# Altium schematic sheet TIDA-01576_ADS8686S_AFE_Pg3-eFuse + 3.3V DC-DC.SchDoc: eFuse + 3.3V DC-DC
size 431 x 279 mm; Date: Not shown in title block; ApprovedBy: Not shown in title block; CheckedBy: Not shown in title block; Author: Not shown in title block; CompanyName: Not shown in title block; DrawnBy: Sreenivasa; Engineer: Not shown in title block; Organization: Not shown in title block; Address1: Not shown in title block; Address2: Not shown in title block; Address3: Not shown in title block; Address4: Not shown in title block; DocumentNumber: 1; Revision: Use project parameter SCH_Rev; SheetNumber: 3; SheetTotal: 7; PageSetup: Record=PageOptions|CenterHorizontal=True|CenterVertical=True|PrintScale=1.00|XCorrection=1.00|YCorrection=1.00|PrintKind=0|BorderSize=5000000|LeftOffset=0|BottomOffset=0|Orientation=2|PaperLength=1000|PaperWidth=1000|Scale=100|PaperSource=15|PrintQuality=600|MediaType=1|DitherType=10|PaperKind=Letter|PrintScaleMode=1; CurrentTime: Not shown in title block; CurrentDate: Not shown in title block; Time: Not shown in title block; DocumentFullPathAndName: Not shown in title block; DocumentName: Not shown in title block; ModifiedDate: Not shown in title block; ImagePath: Not shown in title block
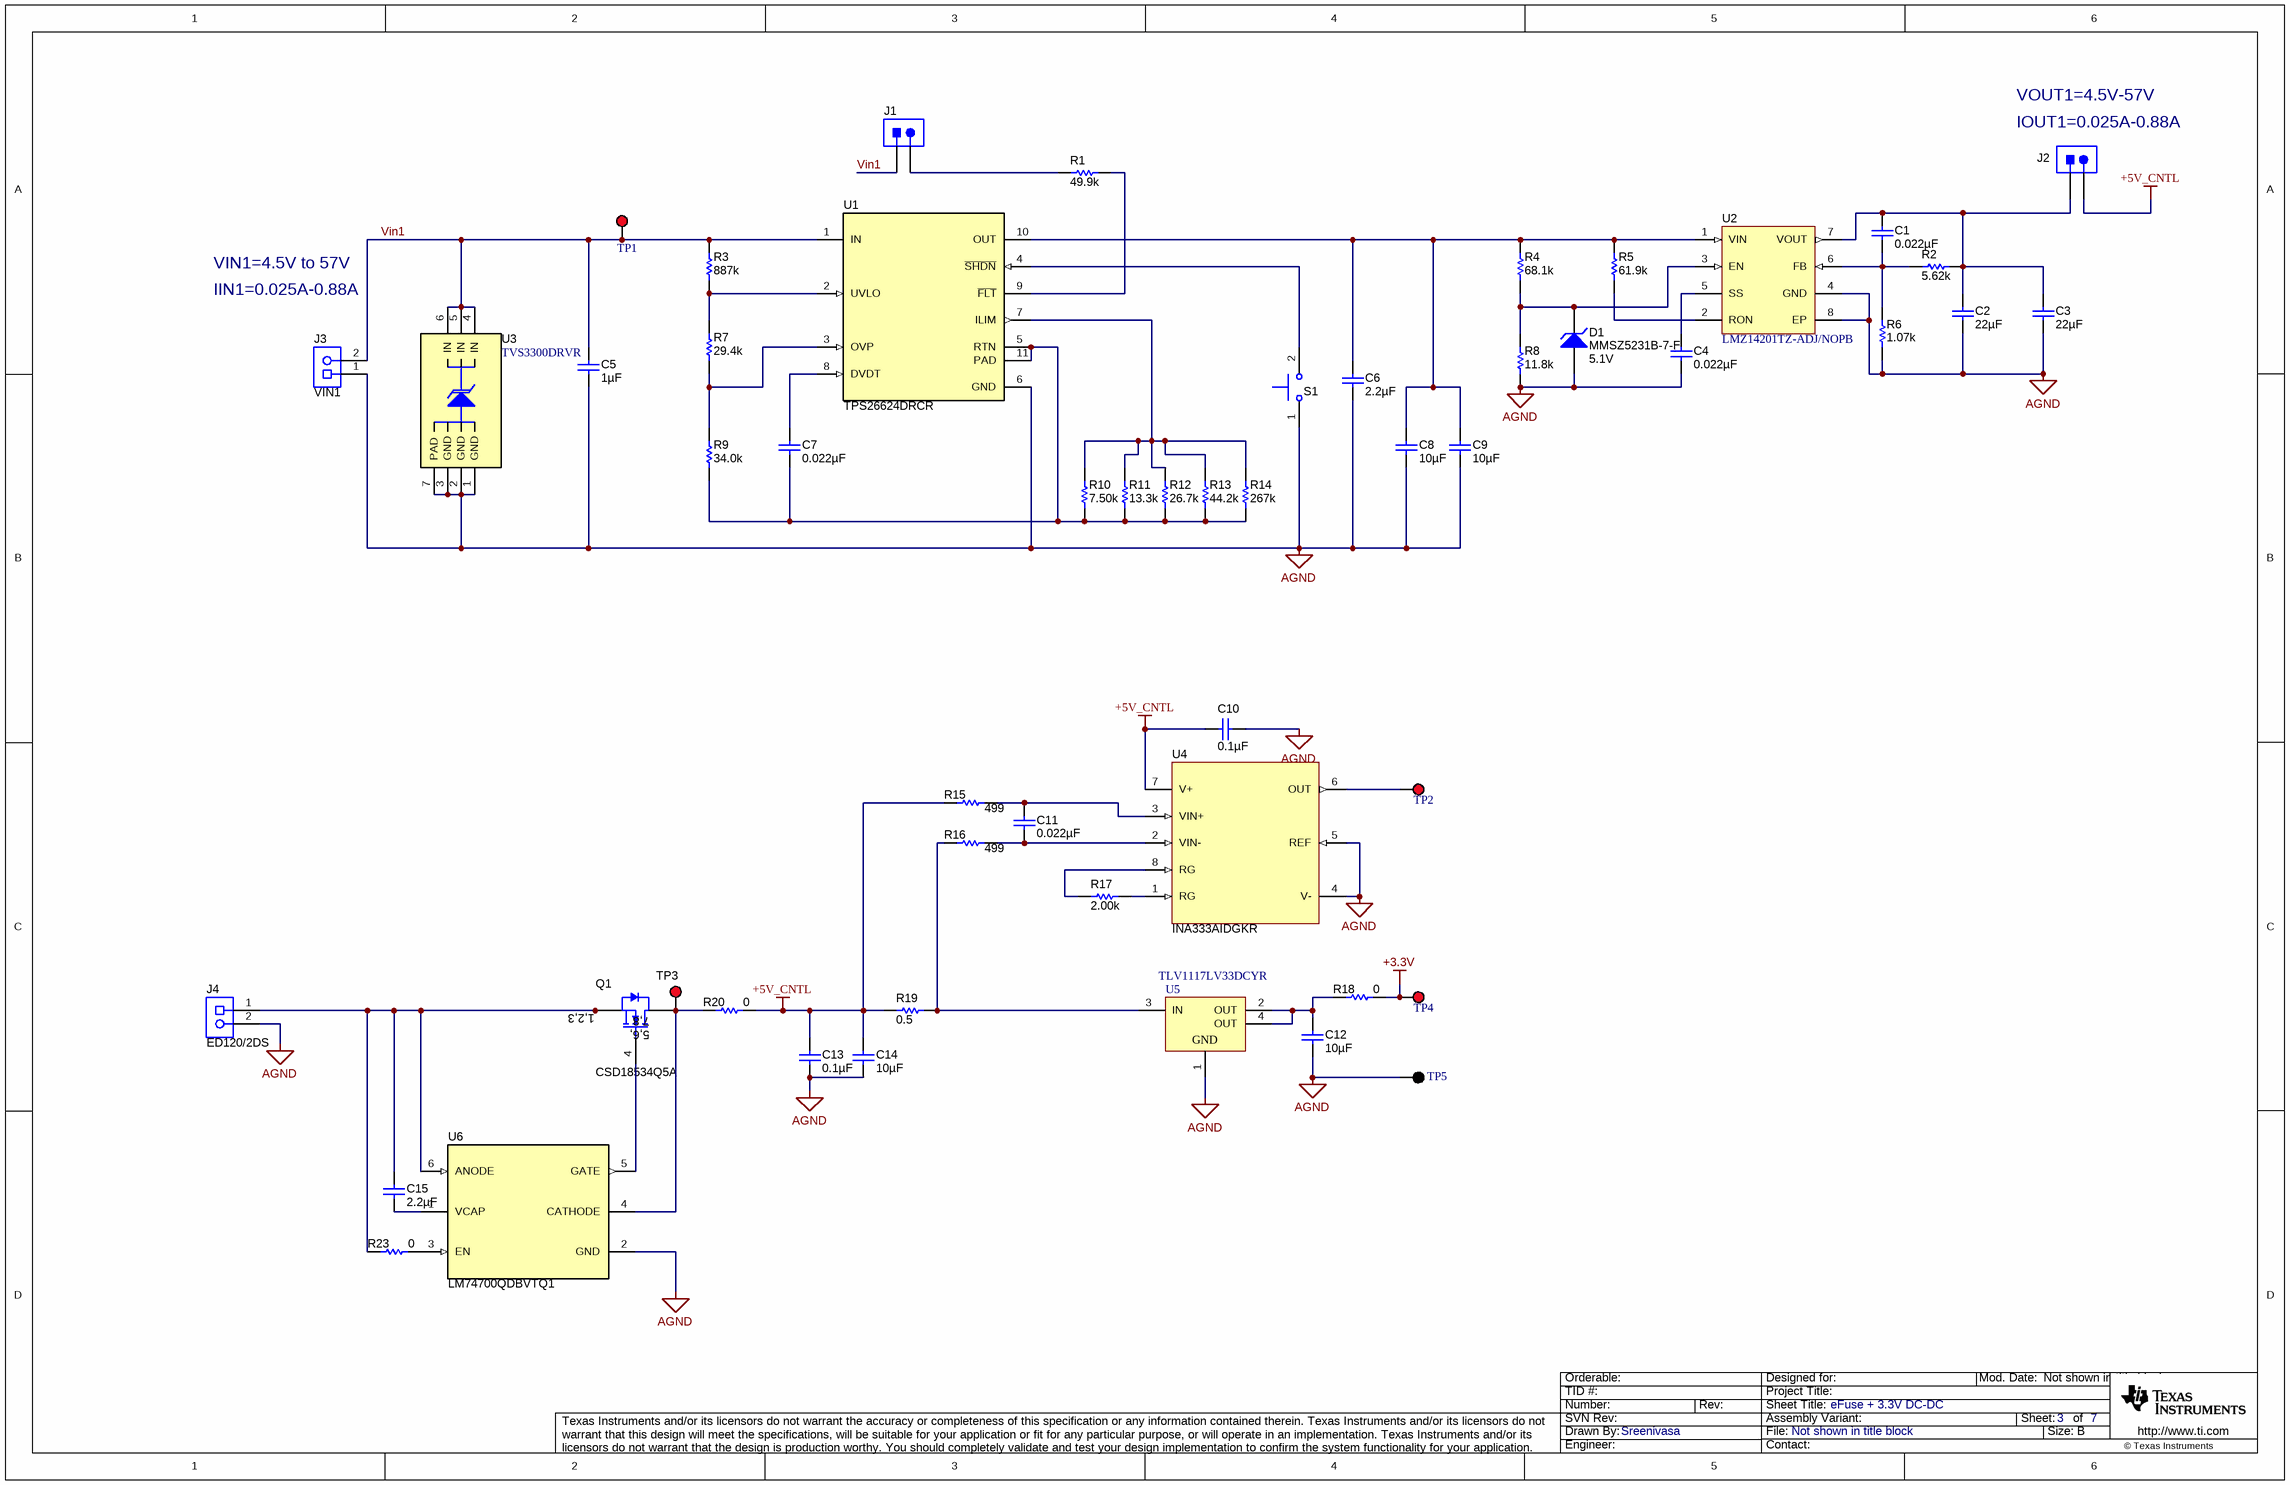
[diagram p0: TIDA-01576_ADS8686S_AFE_Pg3-eFuse + 3.3V DC-DC.SchDoc]

## Parts
C1  ValueDisplayed: 0.022µF  [0603]  (hidden comment: C0603C223K4RACTU)
C2  ValueDisplayed: 22µF  [1206_190]  (hidden comment: EMK316BB7226ML-T)
C3  ValueDisplayed: 22µF  [1206_190]  (hidden comment: EMK316BB7226ML-T)
C4  ValueDisplayed: 0.022µF  [0603]  (hidden comment: C0603C223K4RACTU)
C5  ValueDisplayed: 1µF  [1206_180M]  (hidden comment: GRM31CR72A105KA01L)
C6  ValueDisplayed: 2.2µF  [1210_270]  (hidden comment: GRM32ER72A225KA35L)
C7  ValueDisplayed: 0.022µF  [0603]  (hidden comment: GRM188R71C223KA01D)
C8  ValueDisplayed: 10µF  [1210_270]  (hidden comment: GRM32ER71J106KA12L)
C9  ValueDisplayed: 10µF  [1210_270]  (hidden comment: GRM32ER71J106KA12L)
C10  ValueDisplayed: 0.1µF  [0603M]  (hidden comment: 06033C104JAT2A)
C11  ValueDisplayed: 0.022µF  [0603M]  (hidden comment: C0603C223K3RACTU)
C12  ValueDisplayed: 10µF  [0603]  (hidden comment: C0603C106M9PACTU)
C13  ValueDisplayed: 0.1µF  [0603]  (hidden comment: C0603C104K5RACTU)
C14  ValueDisplayed: 10µF  [0603]  (hidden comment: C0603C106M9PACTU)
C15  ValueDisplayed: 2.2µF  [0805_HV]  (hidden comment: C0805C225K8RACTU)
D1  MMSZ5231B-7-F  value 5.1V  [SOD-123]
J1  PBC02SAAN  [Sullins_PBC02SAAN]  (value not drawn)
J2  PBC02SAAN  [Sullins_PBC02SAAN]  (value not drawn)
J3  VIN1  [TEC_282841-2]
J4  ED120/2DS  [CONN_ED120-2DS]
Q1  CSD18534Q5A  [DQJ0008A]
R1  ValueDisplayed: 49.9k  [0603]  (hidden comment: CRCW060349K9FKEA)
R2  ValueDisplayed: 5.62k  [0603]  (hidden comment: RC0603FR-075K62L)
R3  ValueDisplayed: 887k  [0603]  (hidden comment: CRCW0603887KFKEA)
R4  ValueDisplayed: 68.1k  [1206]  (hidden comment: CRCW120668K1FKEA)
R5  ValueDisplayed: 61.9k  [1206]  (hidden comment: RC1206FR-0761K9L)
R6  ValueDisplayed: 1.07k  [0603]  (hidden comment: ERA-3AEB1071V)
R7  ValueDisplayed: 29.4k  [0603]  (hidden comment: CRCW060329K4FKEA)
R8  ValueDisplayed: 11.8k  [1206]  (hidden comment: CRCW120611K8FKEA)
R9  ValueDisplayed: 34.0k  [0603]  (hidden comment: CRCW060334K0FKEA)
R10  ValueDisplayed: 7.50k  [0603]  (hidden comment: CRCW06037K50FKEA)
R11  ValueDisplayed: 13.3k  [0603]  (hidden comment: CRCW060313K3FKEA)
R12  ValueDisplayed: 26.7k  [0603]  (hidden comment: CRCW060326K7FKEA)
R13  ValueDisplayed: 44.2k  [0603]  (hidden comment: CRCW060344K2FKEA)
R14  ValueDisplayed: 267k  [0603]  (hidden comment: CRCW0603267KFKEA)
R15  value 499  [0402M]  (hidden comment: CRCW0402499RFKED)
R16  value 499  [0402M]  (hidden comment: CRCW0402499RFKED)
R17  ValueDisplayed: 2.00k  [0402]  (hidden comment: CRCW04022K00FKED)
R18  value 0  [0603]  (hidden comment: CRCW06030000Z0EA)
R19  ValueDisplayed: 0.5  [RL1220]  (hidden comment: RL1220S-R50-F)
R20  value 0  [0603]  (hidden comment: CRCW06030000Z0EA)
R23  value 0  [0603]  (hidden comment: CRCW06030000Z0EA)
S1  PTS820 J20M SMTR LFS  [SW_PTS820]  (value not drawn)
TP1  5000  [Keystone5000]  (value not drawn)
TP2  5000  [Keystone5000]  (value not drawn)
TP3  5000  [Keystone5000]  (value not drawn)
TP4  5000  [Keystone5000]  (value not drawn)
TP5  5001  [Keystone5001]  (value not drawn)
U1  TPS26624DRCR  [DRC0010J]
U2  LMZ14201TZ-ADJ/NOPB  [TZA07A_V]
U3  TVS3300DRVR  [DRV0006A]
U4  INA333AIDGKR  [DGK0008A_N]
U5  TLV1117LV33DCYR  [DCY0004A_N]
U6  LM74700QDBVTQ1  [DBV0006A_N]

## Nets
+3.3V: R18.2 TP4.1
+5V_CNTL: C10.2 C13.1 C14.1 J2.2 R15.1 R19.1 R20.2 U4.7(V+)
AGND: C2.2 C3.2 C4.2 C5.2 C6.2 C8.2 C9.2 C10.1 C12.2 C13.2 C14.2 D1.2(A) J3.1 J4.2 R6.1 R8.1 S1.1 TP5.1 U1.6(GND) U2.4(GND) U2.8(EP) U3.1(GND) U3.2(GND) U3.3(GND) U3.7(PAD) U4.4(V-) U4.5(REF) U5.1(GND) U6.2(GND)
Vin1: C5.1 J1.1 J3.2 R3.2 TP1.1 U1.1(IN) U3.4(IN) U3.5(IN) U3.6(IN)
NetC1_1: C1.1 C2.1 C3.1 J2.1 R2.2 U2.7(VOUT)
NetC1_2: C1.2 R2.1 R6.2 U2.6(FB)
NetC4_1: C4.1 U2.5(SS)
NetC6_1: C6.1 C8.1 C9.1 R4.2 R5.2 U1.10(OUT) U2.1(VIN)
NetC7_1: C7.1 U1.8(DVDT)
NetC7_2: C7.2 R9.1 R10.1 R11.1 R12.1 R13.1 R14.1 U1.5(RTN) U1.11(PAD)
NetC11_1: C11.1 R15.2 U4.3(VIN+)
NetC11_2: C11.2 R16.2 U4.2(VIN-)
NetC12_1: C12.1 R18.1 U5.2(OUT) U5.4(OUT)
NetC15_1: C15.1 J4.1 Q1.1(S) Q1.2(S) Q1.3(S) R23.1 U6.6(ANODE)
NetC15_2: C15.2 U6.1(VCAP)
NetD1_1: D1.1(K) R4.1 R8.2 U2.3(EN)
NetJ1_2: J1.2 R1.2
NetQ1_4: Q1.4(G) U6.5(GATE)
NetQ1_5: Q1.5(D) Q1.6(D) Q1.7(D) Q1.8(D) Q1.9(D) R20.1 TP3.1 U6.4(CATHODE)
NetR1_1: R1.1 U1.9(~{FLT})
NetR3_1: R3.1 R7.2 U1.2(UVLO)
NetR5_1: R5.1 U2.2(RON)
NetR7_1: R7.1 R9.2 U1.3(OVP)
NetR10_2: R10.2 R11.2 R12.2 R13.2 R14.2 U1.7(ILIM)
NetR16_1: R16.1 R19.2 U5.3(IN)
NetR17_1: R17.1 U4.1(RG)
NetR17_2: R17.2 U4.8(RG)
NetR23_2: R23.2 U6.3(EN)
NetS1_2: S1.2 U1.4(~{SHDN})
NetTP2_1: TP2.1 U4.6(OUT)

## Notes on the sheet
- VOUT1=4.5V-57V
- (near J2) IOUT1=0.025A-0.88A
- VIN1=4.5V to 57V
- IIN1=0.025A-0.88A
- Drawn By:
- SVN Rev:
- Number:
- TID #:
- Orderable:
- Rev:
- Sheet Title:
- File:
- Project Title:
- Designed for:
- Assembly Variant:
- Mod. Date:
- Sheet:
- Size:
- of
- B
- http://www.ti.com
- Texas Instruments and/or its licensors do not warrant the accuracy or completeness of this specification or any information contained therein. Texas Instruments and/or its licensors do not warrant that this design will meet the specifications, will be suitable for your application or fit for any particular purpose, or will operate in an implementation. Texas Instruments and/or its licensors do not warrant that the design is production worthy. You should completely validate and test your design implementation to confirm the system functionality for your application.
- Engineer:
- Contact:
- © Texas Instruments
- (in symbol CMP-0000817-1) 1,2,3; 7,8; 5,6,

## Library data of the parts
C1 C4 = C0603C223K4RACTU: CAP, CERM, 0.022 µF, 16 V,+/- 10%, X7R, 0603; Manufacturer: Kemet; Polarized: N; CompType: Capacitor; Value: 0.022uF; U/M: EA; Cap_F: 0.000000022; Tolerance_%: 10; Value1: Unknown; VDC_V: 16; Value2: 16V; TaMin_C: -55; TaMax_C: 125; SizeArea_mm2: 1.28; SizeAreaWB_mm2: 4.68; SizeX_mm: 1.6; SizeY_mm: 0.8; SizeZ_mm: 1; AEC Category: Q200; Green_Lifecycle: Active; Green_REACh: Passed; SymbolVersion: 2008-07-09; PartNumber: C0603C223K4RACTU; PackageReference: 0603; RoHS: Y; MountType: SMT; Technology: Ceramic; TempCo: X7R; Cap_Case: 0603; Published: 2008-06-19; Publisher: Texas Instruments; LatestRevisionDate: 2017-05-28; ComponentLink1Description: Datasheet link; ComponentLink1URL: http://www.kemet.com/kemet/web/homepage/kechome.nsf/vapubfiles/F3102_Y5V.pdf/$file/F3102_Y5V.pdf; Supplier 1: Digi-Key; Supplier Part Number 1: 399-1093-1-ND; Supplier 2: Mouser; Supplier Part Number 2: 80-C0603C223K4R; Supplier 3: Farnell; Supplier Part Number 3: 1204523; AEC Qualified: ?; Green_EU RoHS: Passed; Green_EU RoHS-2: Passed
C2 C3 = EMK316BB7226ML-T: CAP, CERM, 22 µF, 16 V,+/- 20%, X7R, 1206; Manufacturer: Taiyo Yuden; Polarized: N; CompType: Capacitor; Value: 22uF; U/M: EA; Cap_F: 0.000022; Tolerance_%: 20; Value1: Unknown; VDC_V: 16; Value2: 16V; TaMin_C: -55; TaMax_C: 125; Cap_Case: 1206; SizeArea_mm2: 5.12; SizeAreaWB_mm2: 10.92; SizeX_mm: 3.2; SizeY_mm: 1.6; SizeZ_mm: 1.9; AEC Category: Q200; SymbolVersion: 2008-07-09; PartNumber: EMK316BB7226ML-T; PackageReference: 1206; RoHS: Y; MountType: SMT; Technology: Ceramic; TempCo: X7R; Published: 2008-06-19; Publisher: Texas Instruments; LatestRevisionDate: 2017-05-28; ComponentLink1Description: Datasheet link; ComponentLink1URL: http://www.yuden.co.jp/productdata/catalog/en/mlcc_all_e.pdf; Supplier 1: Digi-Key; Supplier Part Number 1: 587-4319-1-ND; Supplier 2: Newark; Supplier Part Number 2: 52Y4678; Supplier 3: Mouser; Supplier Part Number 3: 963-EMK316BB7226ML-T; AEC Qualified: N; AEC Grade: N/A
C5 = GRM31CR72A105KA01L: CAP, CERM, 1 µF, 100 V, +/- 10%, X7R, 1206; Manufacturer: MuRata; Polarized: N; CompType: Capacitor; Value: 1uF; U/M: EA; Cap_F: 0.000001; Tolerance_%: 10; Value1: Unknown; VDC_V: 100; Value2: 100V; TaMin_C: -55; TaMax_C: 125; Cap_Case: 2220; SizeArea_mm2: 5.12; SizeAreaWB_mm2: 10.92; SizeX_mm: 3.2; SizeY_mm: 1.6; SizeZ_mm: 1.8; AEC Category: Q200; SymbolVersion: 2008-07-09; PartNumber: GRM31CR72A105KA01L; PackageReference: 1206; RoHS: Y; MountType: SMT; Technology: Ceramic; TempCo: X7R; Published: 2008-06-19; Publisher: Texas Instruments; LatestRevisionDate: 2016-06-23; ComponentLink1Description: Datasheet link; ComponentLink1URL: http://search.murata.co.jp/Ceramy/PnsearchViewAction.do?HnOFG=ON&HnNFG=ON&SEL_CNT=50&sLang=en&sKey=GRM31CR72A105KA01L&x=9&y=9&search=startwith; Supplier 1: Digi-Key; Supplier Part Number 1: 490-3909-1-ND; Supplier 2: Mouser; Supplier Part Number 2: 81-GRM31CR72A105KA01; Supplier 3: Farnell; Supplier Part Number 3: 1735543; AEC Qualified: ?
C6 = GRM32ER72A225KA35L: CAP, CERM, 2.2 µF, 100 V, +/- 10%, X7R, 1210; Manufacturer: MuRata; Polarized: N; CompType: Capacitor; Value: 2.2uF; U/M: EA; Cap_F: 0.0000022; Tolerance_%: 10; ESR_ohm: 0.007; Value1: 0.007 ohm; VDC_V: 100; Value2: 100V; IRMS_A: 4.4; TaMin_C: -55; TaMax_C: 125; Cap_Case: 1210; SizeArea_mm2: 8; SizeAreaWB_mm2: 14.7; SizeX_mm: 3.2; SizeY_mm: 2.5; SizeZ_mm: 2.7; AEC Category: Q200; SymbolVersion: 2008-07-09; PartNumber: GRM32ER72A225KA35L; PackageReference: 1210; RoHS: Y; MountType: SMT; Technology: Ceramic; TempCo: X7R; Published: 2008-06-19; Publisher: Texas Instruments; LatestRevisionDate: 2017-01-30; ComponentLink1Description: Datasheet link; ComponentLink1URL: http://search.murata.co.jp/Ceramy/PnsearchViewAction.do?HnOFG=ON&HnNFG=ON&SEL_CNT=50&sLang=en&sKey=GRM32ER72A225KA35L&x=9&y=9&search=startwith; Supplier 1: Digi-Key; Supplier Part Number 1: 490-3385-1-ND; Supplier 2: Mouser; Supplier Part Number 2: 81-GRM32ER72A225KA35; Supplier 3: Farnell; Supplier Part Number 3: 1735547; AEC Qualified: ?
C7 = GRM188R71C223KA01D: CAP, CERM, 0.022 µF, 16 V,+/- 10%, X7R, 0603; Manufacturer: MuRata; Polarized: N; CompType: Capacitor; Value: 0.022uF; U/M: EA; Cap_F: 0.000000022; Tolerance_%: 10; VDC_V: 16; Value2: 16V; TaMin_C: -55; TaMax_C: 125; SizeArea_mm2: 1.28; SizeAreaWB_mm2: 4.68; SizeX_mm: 1.6; SizeY_mm: 0.8; SizeZ_mm: 1; AEC Category: Q200; Green_Lifecycle: Active; Green_REACh: Passed; SymbolVersion: 2008-07-09; PartNumber: GRM188R71C223KA01D; PackageReference: 0603; RoHS: Y; MountType: SMT; Technology: Ceramic; TempCo: X7R; Cap_Case: 0603; Published: 2008-06-19; Publisher: Texas Instruments; LatestRevisionDate: 2017-06-22; ComponentLink1Description: Datasheet link; ComponentLink1URL: http://search.murata.co.jp/Ceramy/PnsearchViewAction.do?HnOFG=ON&HnNFG=ON&SEL_CNT=50&sLang=en&sKey=GRM188R71C223KA01D&x=9&y=9&search=startwith; Supplier 1: Digi-Key; Supplier Part Number 1: 490-1527-1-ND; Supplier 2: Mouser; Supplier Part Number 2: 81-GRM39X223K16D; AEC Qualified: ?; Green_EU RoHS: Passed; Green_EU RoHS-2: Incomplete
C8 C9 = GRM32ER71J106KA12L: CAP, CERM, 10 µF, 63 V, +/- 10%, X7R, 1210; Manufacturer: MuRata; Polarized: N; CompType: Capacitor; Value: 10uF; U/M: EA; Cap_F: 0.00001; Tolerance_%: 10; Value1: Unknown; VDC_V: 63; Value2: 63V; TaMin_C: -55; TaMax_C: 125; Cap_Case: 1210; SizeArea_mm2: 8; SizeAreaWB_mm2: 14.7; SizeX_mm: 3.2; SizeY_mm: 2.5; SizeZ_mm: 2.7; AEC Category: Q200; SymbolVersion: 2008-07-09; PartNumber: GRM32ER71J106KA12L; PackageReference: 1210; RoHS: Y; MountType: SMT; Technology: Ceramic; TempCo: X7R; Published: 2008-06-19; Publisher: Texas Instruments; LatestRevisionDate: 2016-12-20; ComponentLink1Description: Datasheet link; ComponentLink1URL: http://psearch.en.murata.com/capacitor/product/GRM32ER71J106KA12%23.pdf; Supplier 1: Digi-Key; Supplier Part Number 1: 490-9970-1-ND; Supplier 2: Mouser; Supplier Part Number 2: 81-GRM32ER71J106KA2L; AEC Qualified: N; AEC Grade: N/A
C10 = 06033C104JAT2A: CAP, CERM, 0.1uF, 25V, +/-5%, X7R, 0603; Manufacturer: AVX; Polarized: N; CompType: Capacitor; U/M: EA; Cap_F: 0.0000001; Tolerance_%: 5; ESR_Ohm: 0.05; Value1: 0.05 ohm; VDC_V: 25; TaMin_C: -55; TaMax_C: 125; Cap_Case: 0603; SymbolVersion: 2008-07-09; Value: 0.1uF; PartNumber: 06033C104JAT2A; PackageReference: 0603; RoHS: Y; Value2: 25V; MountType: SMT; Technology: Ceramic; TempCo: X7R; Published: 2008-06-19; Publisher: Texas Instruments; LatestRevisionDate: 2013-06-11; ComponentLink1Description: Datasheet link; ComponentLink1URL: http://www.avx.com/docs/masterpubs/smccp.pdf; Supplier 1: Digi-Key; Supplier Part Number 1: 478-3713-1-ND; Supplier 2: Mouser; Supplier Part Number 2: 581-06033C104JAT2A; Supplier 3: Farnell; Supplier Part Number 3: 1740614
C11 = C0603C223K3RACTU: CAP, CERM, 0.022uF, 25V, +/-10%, X7R, 0603; Manufacturer: Kemet; Polarized: N; CompType: Capacitor; U/M: EA; Cap_F: 0.000000022; Tolerance_%: 10; Value1: Unknown; VDC_V: 25; TaMin_C: -55; TaMax_C: 125; Cap_Case: 0603; SymbolVersion: 2008-07-09; Value: 0.022uF; PartNumber: C0603C223K3RACTU; PackageReference: 0603; RoHS: Y; Value2: 25V; MountType: SMT; Technology: Ceramic; TempCo: X7R; Published: 2008-06-19; Publisher: Texas Instruments; LatestRevisionDate: 2014-01-01; ComponentLink1Description: Datasheet link; ComponentLink1URL: http://www.kemet.com/kemet/web/homepage/kechome.nsf/vapubfiles/F3102_Y5V.pdf/$file/F3102_Y5V.pdf; Supplier 1: Digi-Key; Supplier Part Number 1: 399-1094-1-ND; Supplier 2: Mouser; Supplier Part Number 2: 80-C0603C223K3R; Supplier 3: Farnell; Supplier Part Number 3: 1204523
C12 C14 = C0603C106M9PACTU: CAP, CERM, 10 µF, 6.3 V, +/- 20%, X5R, 0603; Manufacturer: Kemet; Polarized: N; CompType: Capacitor; Value: 10uF; U/M: EA; Cap_F: 0.00001; Tolerance_%: 20; ESR_ohm: 0.004; Value1: 0.004 ohm; VDC_V: 6.3; Value2: 6.3V; IRMS_A: 8.9; TaMin_C: -55; TaMax_C: 85; SymbolVersion: 2008-07-09; PartNumber: C0603C106M9PACTU; PackageReference: 0603; RoHS: Y; MountType: SMT; Technology: Ceramic; TempCo: X5R; Cap_Case: 0603; Published: 2008-06-19; Publisher: Texas Instruments; LatestRevisionDate: 2015-03-22; ComponentLink1Description: Datasheet link; ComponentLink1URL: http://www.kemet.com/kemet/web/homepage/kechome.nsf/vapubfiles/F3102_Y5V.pdf/$file/F3102_Y5V.pdf; Supplier 1: Digi-Key; Supplier Part Number 1: 399-5504-1-ND; Supplier 2: Mouser; Supplier Part Number 2: 80-C0603C106M9P; Supplier 3: Farnell; Supplier Part Number 3: 1288201
C13 = C0603C104K5RACTU: CAP, CERM, 0.1uF, 50V, +/-10%, X7R, 0603; Manufacturer: Kemet; Polarized: N; CompType: Capacitor; U/M: EA; Cap_F: 0.0000001; Tolerance_%: 10; Value1: Unknown; VDC_V: 50; TaMin_C: -55; TaMax_C: 125; SymbolVersion: 2008-07-09; Value: 0.1uF; PartNumber: C0603C104K5RACTU; PackageReference: 0603; RoHS: Y; Value2: 50V; MountType: SMT; Technology: Ceramic; TempCo: X7R; Cap_Case: 0603; Published: 2008-06-19; Publisher: Texas Instruments; LatestRevisionDate: 2013-11-21; ComponentLink1Description: Datasheet link; ComponentLink1URL: http://www.kemet.com/kemet/web/homepage/kechome.nsf/vapubfiles/F3102_Y5V.pdf/$file/F3102_Y5V.pdf; Supplier 1: Digi-Key; Supplier Part Number 1: 399-5089-1-ND; Supplier 2: Mouser; Supplier Part Number 2: 80-C0603C104K5R; Supplier 3: Farnell; Supplier Part Number 3: 1288255
C15 = C0805C225K8RACTU: CAP, CERM, 2.2uF, 10V, +/-10%, X7R, 0805; Manufacturer: Kemet; Polarized: N; CompType: Capacitor; U/M: EA; Cap_F: 0.0000022; Tolerance_%: 10; ESR_Ohm: 0.008; Value1: 0.008 ohm; IRMS_A: 15.55; TaMin_C: -55; TaMax_C: 125; Cap_Case: 0805; SymbolVersion: 2008-07-09; Value: 2.2uF; PartNumber: C0805C225K8RACTU; PackageReference: 0805; RoHS: Y; VDC_V: 10; Value2: 10V; MountType: SMT; Technology: Ceramic; TempCo: X7R; Published: 2008-06-19; Publisher: Texas Instruments; LatestRevisionDate: 2014-05-28; ComponentLink1Description: Datasheet link; ComponentLink1URL: http://www.kemet.com/kemet/web/homepage/kechome.nsf/file/Partial%20Copy%20-%20Ceramic%20Surface%20Mount%20Capacitors/$file/F3102_CE.pdf; Supplier 1: Digi-Key; Supplier Part Number 1: 399-3522-1-ND; Supplier 2: Mouser; Supplier Part Number 2: 80-C0805C225K8R
D1 = MMSZ5231B-7-F: Diode, Zener, 5.1 V, 500 mW, SOD-123; Manufacturer: Diodes Inc.; SymbolCreator: a0412235; U/M: EA; Power_W: 0.5; Vz_V: 5.1; Value1: 0.5W; RJA_CperW: 350; SizeAreaWB_mm2: 13.095; SizeArea_mm2: 6.545; SizeX_mm: 3.85; SizeY_mm: 1.7; SizeZ_mm: 1.35; AEC Category: Q101; Green_Lifecycle: Active; Green_REACh: Passed; SymbolVersion: 2010-08-25; PartNumber: MMSZ5231B-7-F; PackageReference: SOD-123; CompType: Zener; Vr_V: N/A; MountType: SMT; RoHS: Y; ComponentLink1Description: Datasheet link; ComponentLink1URL: http://www.diodes.com/datasheets/ds18010.pdf; Published: 2008-10-08; Publisher: Texas Instruments; LatestRevisionDate: 2017-05-11; LatestRevisionNote: Updated Supplier Data; Supplier 1: Digi-Key; Supplier Part Number 1: MMSZ5231B-FDICT-ND; Supplier 2: Mouser; Supplier Part Number 2: 621-MMSZ5231B-F; Supplier 3: Farnell; Supplier Part Number 3: 1843699; AEC Qualified: ?; Green_EU RoHS: Passed; Green_EU RoHS-2: Passed
J1 J2 = PBC02SAAN: Header, 100mil, 2x1, Gold, TH; Manufacturer: Sullins Connector Solutions; SymbolCreator: a0412235; Pitch_mm: 2.54; Gender: Male; Shrouded: N; Row_Count: 1; Current_A: 3; Voltage_V: 1800; Cert_UL: Y; SymbolVersion: 2013-10-31; PartNumber: PBC02SAAN; ClassName: Header; CompType: Header; RoHS: Y; PackageReference: Sullins 100mil, 1x2, 230 mil above insulator; MountType: TH; ComponentLink1Description: Datasheet URL; ComponentLink1URL: http://www.sullinscorp.com/catalogs/77_PAGE108-109_.100_MALE_HDR.pdf; Publisher: Texas Instruments; LatestRevisionDate: 2016-06-23; Supplier 1: Digi-Key; Supplier Part Number 1: S1011E-02-ND; Orientation: Vertical; PinCount: 2; ContactFinish: Gold; Color: Black
J3 = CMP-0054973-1: Terminal Block, 2x1, 5.08mm, TH; Manufacturer: TE Connectivity; PartNumber: 282841-2; CNHeader: FALSE; Green_Lifecycle: Active; Green_REACh: Passed; CT: TRUE; CompType: Terminal Block; MountType: TH; RoHS: Y; PackageReference: 10.16x15.2x9mm; ComponentLink1Description: Datasheet URL; ComponentLink1URL: http://www.te.com/commerce/DocumentDelivery/DDEController?Action=srchrtrv&DocNm=282841&DocType=Customer+Drawing&DocLang=English; Supplier 1: Digi-Key; Supplier Part Number 1: A98342-ND; Publisher: Texas Instruments; LatestRevisionDate: 26/05/2017; Supplier 2: Newark; Supplier Part Number 2: 12H8419; Supplier 3: Mouser; Supplier Part Number 3: 571-2828412; Green_EU RoHS-2: Incomplete; Green_EU RoHS: Passed with Exemption
J4 = ED120/2DS: TERMINAL BLOCK 5.08MM VERT 2POS, TH; Manufacturer: On-Shore Technology; SymbolCreator: a0412235; U/M: EA; SymbolVersion: 2013-09-04; PartNumber: ED120/2DS; PackageReference: TERM_BLK, 2pos, 5.08mm; CompType: Terminal Block; RoHS: Y; MountType: TH; ComponentLink1Description: Datasheet Link; ComponentLink1URL: http://www.on-shore.com/sites/default/files/manuals/ed120ds.pdf; Publisher: Texas Instruments; LatestRevisionDate: 2013-12-06; Supplier 1: Digi-Key; Supplier Part Number 1: ED1609-ND
Q1 = CMP-0000817-1: MOSFET, N-CH, 60 V, 50 A, DQJ0008A (VSONP-8); Alternate Manufacturer: None; Manufacturer: Texas Instruments; SizeZ_mm: 1.1; ChType: N; Value2: 22 nC; Value1: 0.009; VdsMax_V: 60V; SizeX_mm: 6; SizeY_mm: 4.9; Vgs_V: 2.3V; Value: 60V; Rdson45_ohm: 9.8m; SizeArea_mm2: 29.4; AEC Category: Q101; IdsMax_A: 50A; SizeAreaWB_mm2: 55.2; U/M: EA; QgTyp_nC: 22; Supplier 2: Newark; Supplier 3: Mouser; Supplier 1: Digi-Key; Supplier Part Number 1: 296-35583-1-ND; Supplier Part Number 2: 63W3706; PartNumber: CSD18534Q5A; ComponentLink1Description: Datasheet link; LatestRevisionDate: 2017-03-09; ComponentLink1URL: http://www.ti.com/lit/ds/symlink/csd18534q5a.pdf; CompType: MOSFET; PackageReference: DQJ0008A; LatestRevisionNote: Added parts.; Publisher: Texas Instruments; AEC Qualified: N; Published: 2008-06-19; Supplier Part Number 3: 595-CSD18534Q5A; RoHS: Y; MountType: SMT
R1 = CRCW060349K9FKEA: RES, 49.9 k, 1%, 0.1 W, 0603; Manufacturer: Vishay-Dale; CompType: Resistor; Value: 49.9k; Res_ohm: 49900; Value_Code: 49k9; Tolerance_%: 1; Power_W: 0.1; Value2: 0.1W; VDC_V: 75; TempCo: 100 ppm/C; EIA_Code: E96; U/M: EA; SizeArea_mm2: 1.28; SizeX_mm: 1.6; SizeY_mm: 0.8; AEC Category: Q200; Green_Lifecycle: Active; Green_REACh: Passed; SymbolVersion: 2009-05-29; PartNumber: CRCW060349K9FKEA; PackageReference: 0603; RoHS: Y; Value1: 1%; MountType: SMT; Technology: Thick Film; Published: 2008-06-26; Publisher: Texas Instruments; LatestRevisionDate: 2017-06-13; ComponentLink1Description: Datasheet link; ComponentLink1URL: http://www.vishay.com/docs/20035/dcrcwe3.pdf; Supplier 1: Digi-Key; Supplier Part Number 1: 541-49.9KHCT-ND; Supplier 2: Mouser; Supplier Part Number 2: 71-CRCW0603-49.9K-E3; Supplier 3: Farnell; Supplier Part Number 3: 1652882; SizeZ_mm: 1; AEC Qualified: ?; Green_EU RoHS: Passed with Exemption; Green_EU RoHS-2: Passed
R2 = RC0603FR-075K62L: RES, 5.62 k, 1%, 0.1 W, 0603; Manufacturer: Yageo America; CompType: Resistor; Value: 5.62k; Res_ohm: 5620; Value_Code: 5k62; Tolerance_%: 1; Power_W: 0.1; Value2: 0.1W; VDC_V: 150; TempCo: 200 ppm/C; SizeArea_mm2: 1.28; SizeX_mm: 1.6; SizeY_mm: 0.8; EIA_Code: E96; U/M: EA; AEC Category: Q200; Green_Lifecycle: Active; Green_REACh: Passed; SymbolVersion: 2009-05-29; PartNumber: RC0603FR-075K62L; PackageReference: 0603; RoHS: Y; Value1: 1%; MountType: SMT; Technology: Thick Film; SizeZ_mm: 1; Published: 2008-06-26; Publisher: Texas Instruments; LatestRevisionDate: 2017-06-13; ComponentLink1Description: Datasheet link; ComponentLink1URL: http://www.yageo.com/pdf/Pu-RC0603_51_PbFree_L_2.pdf; Supplier 1: Digi-Key; Supplier Part Number 1: 311-5.62KHRCT-ND; Supplier 2: Mouser; Supplier Part Number 2: 603-RC0603FR-075K62L; Supplier 3: Farnell; Supplier Part Number 3: 4760311; AEC Qualified: ?; Green_EU RoHS: Passed with Exemption; Green_EU RoHS-2: Passed
R3 = CRCW0603887KFKEA: RES, 887 k, 1%, 0.1 W, 0603; Manufacturer: Vishay-Dale; CompType: Resistor; Value: 887k; Res_ohm: 887000; Tolerance_%: 1; Power_W: 0.1; Value2: 0.1W; VDC_V: 75; TempCo: 100 ppm/C; SizeArea_mm2: 1.28; SizeX_mm: 1.6; SizeY_mm: 0.8; EIA_Code: E96; U/M: EA; AEC Category: Q200; Green_Lifecycle: Active; Green_REACh: Passed; SymbolVersion: 2009-05-29; PartNumber: CRCW0603887KFKEA; PackageReference: 0603; RoHS: Y; Value_Code: 887k; Value1: 1%; MountType: SMT; Technology: Thick Film; SizeZ_mm: 1; Published: 2008-06-26; Publisher: Texas Instruments; LatestRevisionDate: 2017-06-13; ComponentLink1Description: Datasheet link; ComponentLink1URL: http://www.vishay.com/docs/20035/dcrcwe3.pdf; Supplier 1: Digi-Key; Supplier Part Number 1: 541-887KHCT-ND; Supplier 2: Newark; Supplier Part Number 2: 52K8757; Supplier 3: Mouser; Supplier Part Number 3: 71-CRCW0603-887K-E3; AEC Qualified: ?; Green_EU RoHS: Passed with Exemption; Green_EU RoHS-2: Passed
R4 = CRCW120668K1FKEA: RES, 68.1 k, 1%, 0.25 W, 1206; Manufacturer: Vishay-Dale; CompType: Resistor; Value: 68.1k; Res_ohm: 68100; Value_Code: 68k1; Tolerance_%: 1; Power_W: 0.25; Value2: 0.25W; VDC_V: 200; TempCo: 100 ppm/C; SizeArea_mm2: 5.12; SizeX_mm: 3.2; SizeY_mm: 1.6; SizeZ_mm: 1.35; EIA_Code: E96; U/M: EA; AEC Category: Q200; SymbolVersion: 2009-05-29; PartNumber: CRCW120668K1FKEA; PackageReference: 1206; RoHS: Y; Value1: 1%; MountType: SMT; Technology: Thick Film; Published: 2008-06-26; Publisher: Texas Instruments; LatestRevisionDate: 2017-05-17; ComponentLink1Description: Datasheet link; ComponentLink1URL: http://www.vishay.com/docs/20035/dcrcwe3.pdf; Supplier 1: Digi-Key; Supplier Part Number 1: 541-68.1KFCT-ND; Supplier 2: Newark; Supplier Part Number 2: 53K2570; Supplier 3: Mouser; Supplier Part Number 3: 71-CRCW1206-68.1K-E3; AEC Qualified: ?
R5 = RC1206FR-0761K9L: RES, 61.9 k, 1%, 0.25 W, 1206; Manufacturer: Yageo America; CompType: Resistor; Value: 61.9k; Res_ohm: 61900; Value_Code: 61k9; Tolerance_%: 1; Power_W: 0.25; Value2: 0.25W; VDC_V: 200; TempCo: 100 ppm/C; SizeArea_mm2: 5.12; SizeX_mm: 3.2; SizeY_mm: 1.6; SizeZ_mm: 1.35; EIA_Code: E96; U/M: EA; AEC Category: Q200; SymbolVersion: 2009-05-29; PartNumber: RC1206FR-0761K9L; PackageReference: 1206; RoHS: Y; Value1: 1%; MountType: SMT; Technology: Thick Film; Published: 2008-06-26; Publisher: Texas Instruments; LatestRevisionDate: 2017-05-17; ComponentLink1Description: Datasheet link; ComponentLink1URL: http://www.yageo.com/pdf/Pu-RC1206_51_PbFree_L_2.pdf; Supplier 1: Digi-Key; Supplier Part Number 1: 311-61.9KFRCT-ND; Supplier 2: Mouser; Supplier Part Number 2: 603-RC1206FR-0761K9L; AEC Qualified: ?
R6 = RT0603DRE071K07L: RES SMD 1.07KOHM 0.1% 1/10W 0603; Manufacturer: Panasonic; CompType: Resistor; Value: 1.07k; Res_ohm: 1070; Value_Code: 1k07; Tolerance_%: 0.5; Value1: 0.5%; Power_W: 0.1; Value2: 0.1W; VDC_V: 75; TempCo: 50 ppm/C; SizeArea_mm2: 1.28; SizeX_mm: 1.6; SizeY_mm: 0.8; SizeZ_mm: 1; EIA_Code: E192; U/M: EA; AEC Category: Q200; SymbolVersion: 2009-05-29; PartNumber: ERA-3AEB1071V; PackageReference: 0603; RoHS: Y; MountType: SMT; Technology: Thin Film; Published: 2008-06-26; Publisher: Texas Instruments; LatestRevisionDate: 2017-05-04; ComponentLink1Description: Datasheet link; ComponentLink1URL: http://www.yageo.com/pdf/PYu-RT_1-to-0.05_RoHS_L_3.pdf; Supplier 1: Digi-Key; Supplier Part Number 1: P1.07KDBCT-ND; AEC Qualified: ?
R7 = CRCW060329K4FKEA: RES, 29.4 k, 1%, 0.1 W, 0603; Manufacturer: Vishay-Dale; CompType: Resistor; Value: 29.4k; Res_ohm: 29400; Value_Code: 29k4; Tolerance_%: 1; Power_W: 0.1; Value2: 0.1W; VDC_V: 75; TempCo: 100 ppm/C; SizeArea_mm2: 1.28; SizeX_mm: 1.6; SizeY_mm: 0.8; EIA_Code: E96; U/M: EA; AEC Category: Q200; Green_Lifecycle: Active; Green_REACh: Passed; SymbolVersion: 2009-05-29; PartNumber: CRCW060329K4FKEA; PackageReference: 0603; RoHS: Y; Value1: 1%; MountType: SMT; Technology: Thick Film; SizeZ_mm: 1; Published: 2008-06-26; Publisher: Texas Instruments; LatestRevisionDate: 2017-06-13; ComponentLink1Description: Datasheet link; ComponentLink1URL: http://www.vishay.com/docs/20035/dcrcwe3.pdf; Supplier 1: Digi-Key; Supplier Part Number 1: 541-29.4KHCT-ND; Supplier 2: Newark; Supplier Part Number 2: 52K8364; Supplier 3: Mouser; Supplier Part Number 3: 71-CRCW0603-29.4K-E3; AEC Qualified: ?; Green_EU RoHS: Passed with Exemption; Green_EU RoHS-2: Passed
R8 = CRCW120611K8FKEA: RES, 11.8 k, 1%, 0.25 W, 1206; Manufacturer: Vishay-Dale; CompType: Resistor; Value: 11.8k; Res_ohm: 11800; Value_Code: 11k8; Tolerance_%: 1; Power_W: 0.25; Value2: 0.25W; VDC_V: 200; TempCo: 100 ppm/C; SizeArea_mm2: 5.12; SizeX_mm: 3.2; SizeY_mm: 1.6; SizeZ_mm: 1.35; EIA_Code: E96; U/M: EA; AEC Category: Q200; SymbolVersion: 2009-05-29; PartNumber: CRCW120611K8FKEA; PackageReference: 1206; RoHS: Y; Value1: 1%; MountType: SMT; Technology: Thick Film; Published: 2008-06-26; Publisher: Texas Instruments; LatestRevisionDate: 2017-05-17; ComponentLink1Description: Datasheet link; ComponentLink1URL: http://www.vishay.com/docs/20035/dcrcwe3.pdf; Supplier 1: Digi-Key; Supplier Part Number 1: 541-11.8KFCT-ND; Supplier 2: Newark; Supplier Part Number 2: 53K1933; Supplier 3: Mouser; Supplier Part Number 3: 71-CRCW1206-11.8K-E3; AEC Qualified: ?
R9 = CRCW060334K0FKEA: RES, 34.0 k, 1%, 0.1 W, 0603; Manufacturer: Vishay-Dale; CompType: Resistor; Value: 34.0k; Res_ohm: 34000; Value_Code: 34k0; Tolerance_%: 1; Power_W: 0.1; Value2: 0.1W; VDC_V: 75; TempCo: 100 ppm/C; EIA_Code: E96; U/M: EA; SizeArea_mm2: 1.28; SizeX_mm: 1.6; SizeY_mm: 0.8; AEC Category: Q200; SymbolVersion: 2009-05-29; PartNumber: CRCW060334K0FKEA; PackageReference: 0603; RoHS: Y; Value1: 1%; MountType: SMT; Technology: Thick Film; Published: 2008-06-26; Publisher: Texas Instruments; LatestRevisionDate: 2017-06-13; ComponentLink1Description: Datasheet link; ComponentLink1URL: http://www.vishay.com/docs/20035/dcrcwe3.pdf; Supplier 1: Digi-Key; Supplier Part Number 1: 541-34.0KHCT-ND; Supplier 2: Newark; Supplier Part Number 2: 52K8436; Supplier 3: Mouser; Supplier Part Number 3: 71-CRCW0603-34K-E3; SizeZ_mm: 1; AEC Qualified: ?
R10 = CRCW06037K50FKEA: RES, 7.50 k, 1%, 0.1 W, 0603; Manufacturer: Vishay-Dale; CompType: Resistor; Value: 7.50k; Res_ohm: 7500; Value_Code: 7k50; Tolerance_%: 1; Power_W: 0.1; Value2: 0.1W; VDC_V: 75; TempCo: 100 ppm/C; SizeArea_mm2: 1.28; SizeX_mm: 1.6; SizeY_mm: 0.8; EIA_Code: E96; U/M: EA; AEC Category: Q200; SymbolVersion: 2009-05-29; PartNumber: CRCW06037K50FKEA; PackageReference: 0603; RoHS: Y; Value1: 1%; MountType: SMT; Technology: Thick Film; SizeZ_mm: 1; Published: 2008-06-26; Publisher: Texas Instruments; LatestRevisionDate: 2016-12-16; ComponentLink1Description: Datasheet link; ComponentLink1URL: http://www.vishay.com/docs/20035/dcrcwe3.pdf; Supplier 1: Digi-Key; Supplier Part Number 1: 541-7.50KHCT-ND; Supplier 2: Mouser; Supplier Part Number 2: 71-CRCW0603-7.5K-E3; Supplier 3: Farnell; Supplier Part Number 3: 1469835; AEC Qualified: ?
R11 = CRCW060313K3FKEA: RES, 13.3 k, 1%, 0.1 W, 0603; Manufacturer: Vishay-Dale; CompType: Resistor; Value: 13.3k; Res_ohm: 13300; Value_Code: 13k3; Tolerance_%: 1; Power_W: 0.1; Value2: 0.1W; VDC_V: 75; TempCo: 100 ppm/C; SizeArea_mm2: 1.28; SizeX_mm: 1.6; SizeY_mm: 0.8; EIA_Code: E96; U/M: EA; AEC Category: Q200; SymbolVersion: 2009-05-29; PartNumber: CRCW060313K3FKEA; PackageReference: 0603; RoHS: Y; Value1: 1%; MountType: SMT; Technology: Thick Film; SizeZ_mm: 1; Published: 2008-06-26; Publisher: Texas Instruments; LatestRevisionDate: 2016-12-16; ComponentLink1Description: Datasheet link; ComponentLink1URL: http://www.vishay.com/docs/20035/dcrcwe3.pdf; Supplier 1: Digi-Key; Supplier Part Number 1: 541-13.3KHCT-ND; Supplier 2: Mouser; Supplier Part Number 2: 71-CRCW0603-13.3K-E3; Supplier 3: Farnell; Supplier Part Number 3: 1652840; AEC Qualified: ?
R12 = CRCW060326K7FKEA: RES, 26.7 k, 1%, 0.1 W, 0603; Manufacturer: Vishay-Dale; CompType: Resistor; Value: 26.7k; Res_ohm: 26700; Value_Code: 26k7; Tolerance_%: 1; Power_W: 0.1; Value2: 0.1W; VDC_V: 75; TempCo: 100 ppm/C; SizeArea_mm2: 1.28; SizeX_mm: 1.6; SizeY_mm: 0.8; EIA_Code: E96; U/M: EA; AEC Category: Q200; SymbolVersion: 2009-05-29; PartNumber: CRCW060326K7FKEA; PackageReference: 0603; RoHS: Y; Value1: 1%; MountType: SMT; Technology: Thick Film; SizeZ_mm: 1; Published: 2008-06-26; Publisher: Texas Instruments; LatestRevisionDate: 2016-12-16; ComponentLink1Description: Datasheet link; ComponentLink1URL: http://www.vishay.com/docs/20035/dcrcwe3.pdf; Supplier 1: Digi-Key; Supplier Part Number 1: 541-26.7KHCT-ND; Supplier 2: Mouser; Supplier Part Number 2: 71-CRCW0603-26.7K-E3; Supplier 3: Farnell; Supplier Part Number 3: 1768183; AEC Qualified: ?
R13 = CRCW060344K2FKEA: RES, 44.2 k, 1%, 0.1 W, 0603; Manufacturer: Vishay-Dale; CompType: Resistor; Value: 44.2k; Res_ohm: 44200; Value_Code: 44k2; Tolerance_%: 1; Power_W: 0.1; Value2: 0.1W; VDC_V: 75; TempCo: 100 ppm/C; SizeArea_mm2: 1.28; SizeX_mm: 1.6; SizeY_mm: 0.8; EIA_Code: E96; U/M: EA; AEC Category: Q200; SymbolVersion: 2009-05-29; PartNumber: CRCW060344K2FKEA; PackageReference: 0603; RoHS: Y; Value1: 1%; MountType: SMT; Technology: Thick Film; SizeZ_mm: 1; Published: 2008-06-26; Publisher: Texas Instruments; LatestRevisionDate: 2017-01-27; ComponentLink1Description: Datasheet link; ComponentLink1URL: http://www.vishay.com/docs/20035/dcrcwe3.pdf; Supplier 1: Digi-Key; Supplier Part Number 1: 541-44.2KHCT-ND; Supplier 2: Newark; Supplier Part Number 2: 52K8533; Supplier 3: Mouser; Supplier Part Number 3: 71-CRCW0603-44.2K-E3; AEC Qualified: ?
R14 = CRCW0603267KFKEA: RES, 267 k, 1%, 0.1 W, 0603; Manufacturer: Vishay-Dale; CompType: Resistor; Value: 267k; Res_ohm: 267000; Tolerance_%: 1; Power_W: 0.1; Value2: 0.1W; VDC_V: 75; TempCo: 100 ppm/C; SizeArea_mm2: 1.28; SizeX_mm: 1.6; SizeY_mm: 0.8; EIA_Code: E96; U/M: EA; AEC Category: Q200; SymbolVersion: 2009-05-29; PartNumber: CRCW0603267KFKEA; PackageReference: 0603; RoHS: Y; Value_Code: 267k; Value1: 1%; MountType: SMT; Technology: Thick Film; SizeZ_mm: 1; Published: 2008-06-26; Publisher: Texas Instruments; LatestRevisionDate: 2016-12-16; ComponentLink1Description: Datasheet link; ComponentLink1URL: http://www.vishay.com/docs/20035/dcrcwe3.pdf; Supplier 1: Digi-Key; Supplier Part Number 1: 541-267KHCT-ND; Supplier 2: Mouser; Supplier Part Number 2: 71-CRCW0603-267K-E3; Supplier 3: Farnell; Supplier Part Number 3: 1872697; AEC Qualified: ?
R15 R16 = CRCW0402499RFKED: RES, 499 ohm, 1%, 0.063W, 0402; Manufacturer: Vishay-Dale; CompType: Resistor; Value_Code: 499R; Tolerance_%: 1; Power_W: 0.063; VDC_V: 50; TempCo: 100 ppm/C; EIA_Code: E96; U/M: EA; SymbolVersion: 2009-05-29; PartNumber: CRCW0402499RFKED; PackageReference: 0402; RoHS: Y; Res_ohm: 499; Value1: 1%; Value2: 0.063W; MountType: SMT; Technology: Thick Film; Published: 2008-06-26; Publisher: Texas Instruments; LatestRevisionDate: 2013-11-01; ComponentLink1Description: Datasheet link; ComponentLink1URL: http://www.vishay.com/docs/20035/dcrcwe3.pdf; Supplier 1: Digi-Key; Supplier Part Number 1: 541-499LCT-ND; Supplier 2: Mouser; Supplier Part Number 2: 71-CRCW0402-499-E3; Supplier 3: Farnell; Supplier Part Number 3: 1469724
R17 = CRCW04022K00FKED: RES, 2.00 k, 1%, 0.063 W, 0402; Manufacturer: Vishay-Dale; CompType: Resistor; Value: 2.00k; Res_ohm: 2000; Value_Code: 2k00; Tolerance_%: 1; Power_W: 0.063; Value2: 0.063W; VDC_V: 50; TempCo: 100 ppm/C; SizeArea_mm2: 0.5; SizeZ_mm: 0.6; EIA_Code: E96; U/M: EA; AEC Category: Q200; Green_Lifecycle: Active; Green_REACh: Passed; SymbolVersion: 2009-05-29; PartNumber: CRCW04022K00FKED; PackageReference: 0402; RoHS: Y; Value1: 1%; MountType: SMT; Technology: Thick Film; SizeX_mm: 1; SizeY_mm: 0.5; Published: 2008-06-26; Publisher: Texas Instruments; LatestRevisionDate: 2017-06-12; ComponentLink1Description: Datasheet link; ComponentLink1URL: http://www.vishay.com/docs/20035/dcrcwe3.pdf; Supplier 1: Digi-Key; Supplier Part Number 1: 541-2.00KLCT-ND; Supplier 2: Newark; Supplier Part Number 2: 52K6788; Supplier 3: Mouser; Supplier Part Number 3: 71-CRCW0402-2.0K-E3; AEC Qualified: ?; Green_EU RoHS: Passed with Exemption; Green_EU RoHS-2: Passed
R18 R20 R23 = CRCW06030000Z0EA: RES, 0 ohm, 5%, 0.1W, 0603; Manufacturer: Vishay-Dale; CompType: Resistor; Value_Code: 0000; Tolerance_%: 5; Power_W: 0.1; VDC_V: 75; TempCo: 200 ppm/C; EIA_Code: E24; U/M: EA; SymbolVersion: 2009-05-29; PartNumber: CRCW06030000Z0EA; PackageReference: 0603; RoHS: Y; Res_ohm: 0; Value1: 5%; Value2: 0.1W; MountType: SMT; Technology: Thick Film; Published: 2008-06-26; Publisher: Texas Instruments; LatestRevisionDate: 2014-05-20; ComponentLink1Description: Datasheet link; ComponentLink1URL: http://www.vishay.com/docs/20035/dcrcwe3.pdf; Supplier 1: Digi-Key; Supplier Part Number 1: 541-0.0GCT-ND; Supplier 2: Mouser; Supplier Part Number 2: 71-CRCW0603-0-E3; Supplier 3: Farnell; Supplier Part Number 3: 1469739
R19 = RL1220S-R50-F: RES, 0.5, 1%, 0.33 W, 0805; Manufacturer: Susumu Co Ltd; CompType: Resistor; Value: 0.5; Value_Code: R500; Tolerance_%: 1; Power_W: 0.33; Value2: 0.33W; TempCo: 200 ppm/C; SizeArea_mm2: 2.5; SizeX_mm: 2; SizeY_mm: 1.25; SizeZ_mm: 0.7; U/M: EA; AEC Category: Q200; AEC Qualified: N; SymbolVersion: 2009-05-29; PartNumber: RL1220S-R50-F; PackageReference: 0805; RoHS: Y; Res_ohm: 0.5; Value1: 1%; MountType: SMT; Technology: Thin Film; Published: 2008-06-26; Publisher: Texas Instruments; LatestRevisionDate: 2017-06-23; ComponentLink1Description: Datasheet link; ComponentLink1URL: http://www.susumu.co.jp/common/pdf/n_catalog_partition08_en.pdf; Supplier 1: Digi-Key; Supplier Part Number 1: RL12S.50FCT-ND; Supplier 2: Newark; Supplier Part Number 2: 28K1634; Supplier 3: Mouser; Supplier Part Number 3: 754-RL1220S-R50-F; AEC Grade: N/A
S1 = PTS820 J20M SMTR LFS: Switch, SPST-NO,  Off-Mom, 0.05A, 12VDC, SMD; Manufacturer: C&K Components; SymbolCreator: a0412235; VDC_V: 12; PositionCount: 1; CurrentRating_mA: 50; SymbolVersion: 2012-10-29; PartNumber: PTS820 J20M SMTR LFS; MountType: SMT; ComponentLink1Description: Datasheet Link; ComponentLink1URL: http://www.ck-components.com/80184/pts820_4mar13.pdf/; RoHS: Y; Circuit: SPST-NO; SwitchFunction: Off-Mom; Orientation: Top Actuated; CompType: Switch; PackageReference: 3.9x2.9mm; Publisher: Texas Instruments; LatestRevisionDate: 2017-02-03; Supplier 1: Digi-Key; Supplier Part Number 1: CKN10505CT-ND; Supplier 2: Mouser; Supplier Part Number 2: 611-PTS820J20MSMTR
TP1 TP2 TP4 = 5000: Test Point, Miniature, Red, TH; Manufacturer: Keystone; CompType: Test Point Loop; ContactFinish: Silver; Green_Lifecycle: Active; Green_REACh: Passed; SymbolVersion: 2008-04-04; PartNumber: 5000; RoHS: Y; PackageReference: Red Miniature Testpoint; MountType: TH; ComponentLink1Description: Datasheet URL; ComponentLink1URL: http://www.keyelco.com/userAssets/file/M60-2p60.pdf; Publisher: Texas Instruments; LatestRevisionDate: 2017-05-11; Supplier 1: Digi-Key; Supplier Part Number 1: 36-5000-ND; Supplier 2: Mouser; Supplier Part Number 2: 534-5000; Color: Red; Green_EU RoHS: Passed; Green_EU RoHS-2: Incomplete
TP3 = CMP-0055137-1: Test Point, Miniature, Red, TH; Manufacturer: Keystone; CNHeader: FALSE; Green_Lifecycle: Active; Green_REACh: Passed; ContactFinish: Silver; CT: TRUE; ComponentLink1URL: http://www.keyelco.com/userAssets/file/M60-2p60.pdf; Supplier Part Number 2: 534-5000; Publisher: Texas Instruments; Supplier 2: Mouser; Color: Red; RoHS: Y; MountType: TH; Green_EU RoHS-2: Incomplete; Supplier 1: Digi-Key; Green_EU RoHS: Passed; PackageReference: Red Miniature Testpoint; CompType: Test Point; LatestRevisionDate: 26/05/2017; PartNumber: 5000; ComponentLink1Description: Datasheet URL; Supplier Part Number 1: 36-5000-ND
TP5 = 5001: Test Point, Miniature, Black, TH; Manufacturer: Keystone; CompType: Test Point Loop; ContactFinish: Silver; Green_Lifecycle: Active; Green_REACh: Passed; SymbolVersion: 2008-04-04; PartNumber: 5001; PackageReference: Black Miniature Testpoint; RoHS: Y; MountType: TH; ComponentLink1Description: Datasheet URL; ComponentLink1URL: http://www.keyelco.com/userAssets/file/M60-2p60.pdf; Color: Black; Publisher: Texas Instruments; LatestRevisionDate: 2017-05-11; Supplier 1: Digi-Key; Supplier Part Number 1: 36-5001-ND; Supplier 2: Mouser; Supplier Part Number 2: 534-5001; Green_EU RoHS: Passed; Green_EU RoHS-2: Incomplete
U1 = TPS26624DRCR: 7V - 57V, 800mA Industrial eFuse with Integrated Reverse Polarity Protection, DRC0010J (VSON-10); Alternate PartNumber: TPS26625DRCR; Manufacturer: Texas Instruments; SymbolCreator: a0411947; SizeArea_mm2: 9; SizeAreaWB_mm2: 16; SizeX_mm: 3; SizeZ_mm: 1; CompType: IC; U/M: EA; SymbolVersion: 2016-12-21; PartNumber: TPS26624DRCR; PackageReference: DRC0010J; PackageDescription: VSON-10; MountType: SMT; SizeY_mm: 3; ComponentLink1Description: Datasheet Link; ComponentLink1URL: https://sps06.itg.ti.com/sites/KMS/crossdivteams/altium/docs/ComponentDatasheets/TPS2662_Product_Spec_doc.pdf; Publisher: Texas Instruments; LatestRevisionDate: 2017-06-23; Alternate Manufacturer: Texas Instruments
U2 = LMZ14201TZ-ADJ/NOPB: 1A SIMPLE SWITCHER® Power Module with 42V Maximum Input, 7 pin TO-PMOD; Manufacturer: Texas Instruments; PackageTopMarking: NSUZXYTTE#*LMZ14201*TZ-ADJ; PowerWise: Y; Published: 16-Nov-2010; DatasheetVersion: Jun-2010; PackageVersion: revC, 2009; PackageReference: TZA07A; Publisher: Altium Limited; PackageDescription: TO-PMOD-7, 10.16 x 13.77 x 4.57 mm Body, 7 Lead, 1.27mm Pitch, Surface Mount; Supplier 1: Digi-Key; Supplier Part Number 1: LMZ14201TZ-ADJTR-ND; Supplier 2: Digi-Key; Supplier Part Number 2: LMZ14201TZ-ADJCT-ND; Supplier 3: Digi-Key; Supplier Part Number 3: LMZ14201TZ-ADJDKR-ND; PartNumber: LMZ14201TZ-ADJ/NOPB; RoHS: Y; PinCount: 7; CompType: Switcher; ComponentLink1Description: LMZ14201 Datasheet; ComponentLink1URL: http://www.national.com/ds/LM/LMZ14201.pdf; ComponentLink2Description: LMZ14201 Web Page; ComponentLink2URL: http://www.national.com/pf/LM/LMZ14201.html; ComponentLink3Description: TZA07A Package Page; ComponentLink3URL: http://www.national.com/packaging/folders/tza07a.html
U3 = CMP-0013424-7: 33-V Precision Surge Protection Clamp, DRV0006A (WSON-6); Manufacturer: Texas Instruments; Alternate PartNumber: TVS3300DRVT; SizeX_mm: 2; CompType: IC; SizeZ_mm: 0.8; SizeArea_mm2: 4; SizeAreaWB_mm2: 9; U/M: EA; PackageDescription: WSON-6; PartNumber: TVS3300DRVR; ComponentLink1URL: http://www.ti.com/lit/ds/symlink/tvs3300.pdf; ComponentLink1Description: Datasheet Link; SizeY_mm: 2; RoHS: Y; PackageReference: DRV0006A; MountType: SMT; Alternate Manufacturer: Texas Instruments; ComponentLink2Description: Product Folder; ComponentLink2URL: http://www.ti.com/product/tvs3300
U4 = INA333AIDGKR: Low-Power, Zero-Drift, Precision Instrumentation Amplifier, DGK0008A (VSSOP-8); Alternate PartNumber: INA333AIDGKT; Manufacturer: Texas Instruments; SymbolCreator: a0799628; SizeArea_mm2: 15.655; SizeAreaWB_mm2: 35.955; SizeX_mm: 5.05; SizeY_mm: 3.1; SizeZ_mm: 1.1; CompType: IC; U/M: EA; Green_Lifecycle: Active; Green_REACh: Passed; SymbolVersion: 2013-11-20; PartNumber: INA333AIDGKR; PackageReference: DGK0008A; PackageDescription: VSSOP-8; MountType: SMT; ComponentLink1Description: Datasheet Link; ComponentLink1URL: http://www.ti.com/lit/ds/symlink/ina333.pdf; RoHS: Y; Publisher: Texas Instruments; LatestRevisionDate: 2017-06-05; Alternate Manufacturer: Texas Instruments; Green_EU RoHS: Passed; Green_EU RoHS-2: Passed
U5 = CMP-0036760-1: Single Output LDO, 1 A, Fixed 3.3 V Output, 2 to 5.5 V Input, 4-pin SOT-223 (DCY), -40 to 125 degC, Green (RoHS & no Sb/Br); Manufacturer: Texas Instruments; Accuracy(%): 2; Vdo(Typ)(mV): 1200; SubFamily: Single Channel LDO; Vout Adj(Min)(V): 3.3; Vin(Max)(V): 5.5; Iout(Max)(A): 1; Iq(Typ)(mA): 0.05; ComponentLink2Description: Datasheet; Vin(Min)(V): 2; PackageReference: DCY0004A; ComponentLink1URL: http://www.ti.com/; DatasheetVersion: SBVS160A; ComponentLink2URL: http://www.ti.com/general/docs/lit/getliterature.tsp?genericPartNumber=TLV1117LV33&fileType=pdf; Mounting Technology: Surface Mount; ComponentLink3Description: Package Specification; PackageVersion: 4202506/B; Code_JEDEC: TO-261; Eco-Plan: Green (RoHS & no Sb/Br); ComponentLink3URL: http://www.ti.com/litv/pdf/mpds094a; Vout Adj(Max)(V): 3.3; PackageDescription: 4-Pin Plastic Small Outline, Body 3.5 x 6.5 mm, Pitch 2.3 mm; Fixed Output Options(V): 3.3; PartNumber: TLV1117LV33DCYR; ComponentLink1Description: Manufacturer URL
U6 = CMP-0079180-1: Low Iq Always ON Smart Diode Controller, DBV0006A (SOT-23-6); Alternate PartNumber: LM74700QDBVRQ1; Alternate Manufacturer: Texas Instruments; SizeAreaWB_mm2: 14.82; SizeZ_mm: 1.45; SizeX_mm: 2.8; SizeY_mm: 2.9; SizeArea_mm2: 8.12; CompType: IC; AEC Qualified: Y; AEC Category: Q200; ComponentLink1URL: http://www.ti.com/lit/ds/symlink/lm74700-q1.pdf; PackageDescription: SOT-23-6; MountType: SMT; ComponentLink2URL: http://www.ti.com/product/lm74700-q1; ComponentLink3Description: Online Datasheet; ComponentLink2Description: Product Folder; Manufacturer: Texas Instruments; ComponentLink3URL: http://www.ti.com/product/lm74700-q1/datasheet; PackageReference: DBV0006A; PartNumber: LM74700QDBVTQ1; ComponentLink1Description: Datasheet Link